# Altium schematic sheet USB Interface.SchDoc: USB Interface
size A4; SheetNumber: 4; SheetTotal: 10; Project: WSN Z1; Comments: CP2102
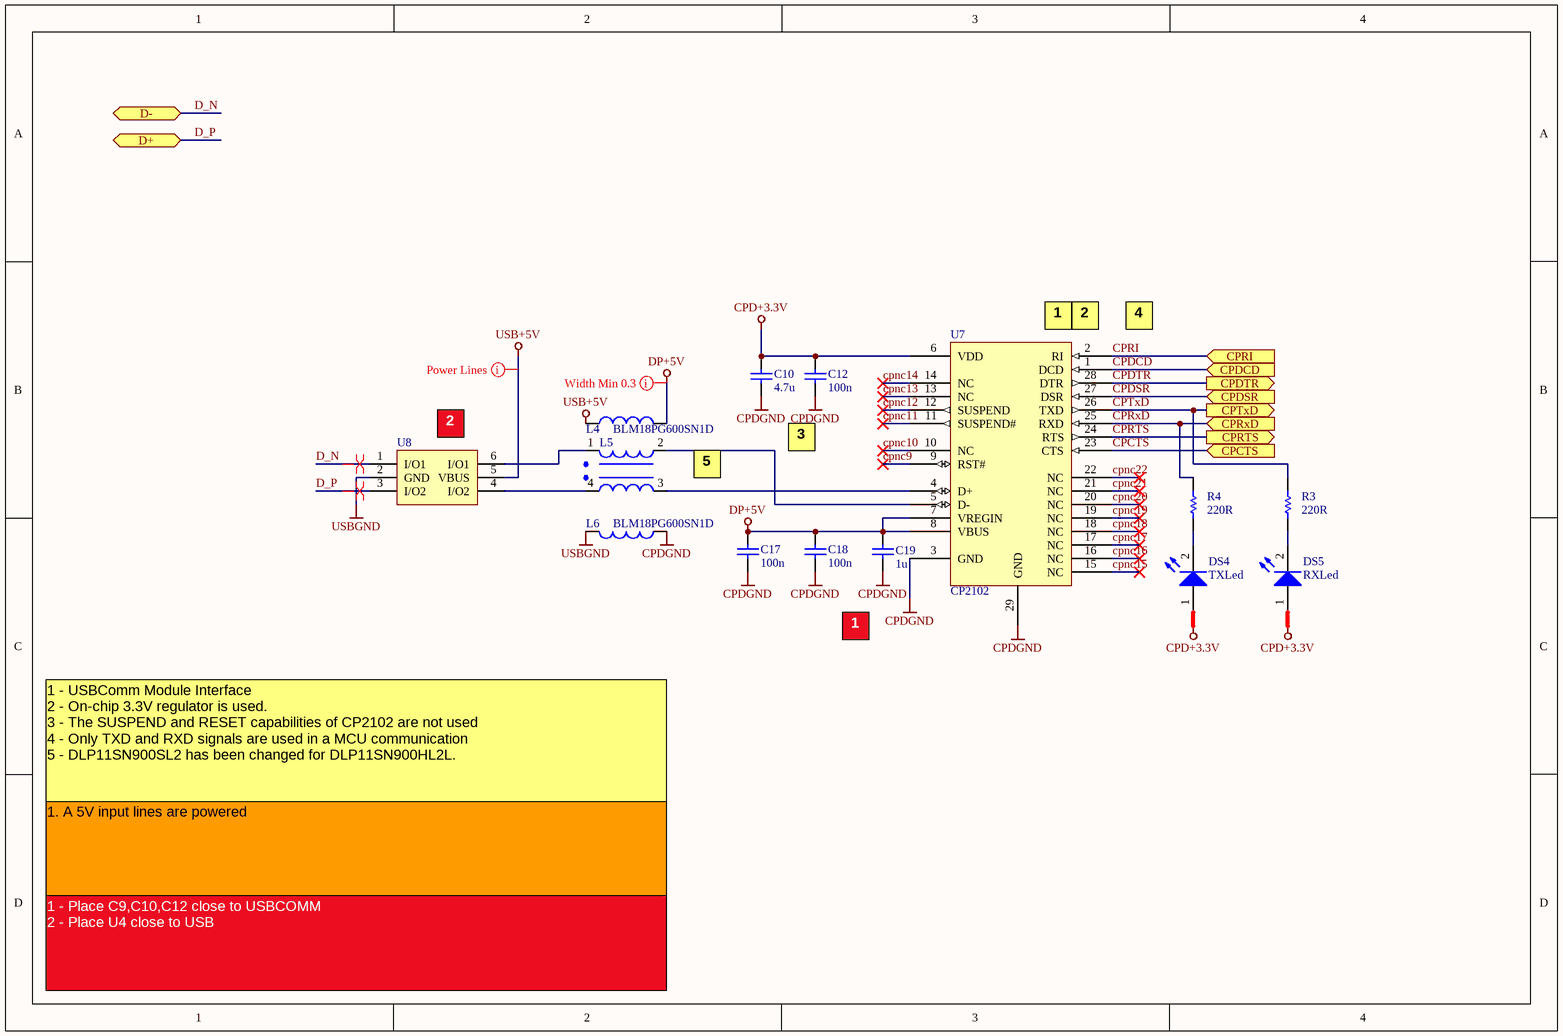
[diagram p0: USB Interface.SchDoc]

## Parts
C10  value 4.7u  [CC1608-0603]  (hidden comment: Cap Semi)
C12  value 100n  [CC-0402-AL]  (hidden comment: Cap Semi)
C17  value 100n  [CC-0402-AL]  (hidden comment: Cap Semi)
C18  value 100n  [CC-0402-AL]  (hidden comment: Cap Semi)
C19  value 1u  [CC1005-0402]  (hidden comment: USB bus decoupling)
DS4  TXLed  [LED0603]
DS5  RXLed  [LED0603]
L4  value BLM18PG600SN1D  [INDC1608-0603]  (hidden comment: Inductor)
L5  DLP11SN900HL2L  [inductor-4pins]  (value not drawn)
L6  value BLM18PG600SN1D  [INDC1608-0603]  (hidden comment: Inductor)
R3  value 220R  [CR-0402-AL]  (hidden comment: Res Semi)
R4  value 220R  [CR-0402-AL]  (hidden comment: Res Semi)
U7  CP2102  [MLP-28]
U8  ESD protection  [SO-G6/E2.4]  (value not drawn)

## Ports
CPCTS (in), CPDCD (in), CPDSR (in), CPDTR (out), CPRI (in), CPRTS (out), CPRxD (in), CPTxD (out), D+ (bidir), D- (bidir)

## Nets
CPD+3.3V: C10.2 C12.1 DS4.1(A) DS5.1(A) U7.6(VDD)
CPDGND: C10.1 C12.2 C17.2 C18.2 C19.2 L6.1 U7.3(GND) U7.29(GND)
DP+5V: C17.1 C18.1 C19.1 L4.2 U7.7(VREGIN) U7.8(VBUS)
USB+5V: L4.1 U8.5(VBUS)
USBGND: L6.2 U8.2(GND)
CPCTS: U7.23(CTS) ; port CPCTS
CPDCD: U7.1(DCD) ; port CPDCD
CPDSR: U7.27(DSR) ; port CPDSR
CPDTR: U7.28(DTR) ; port CPDTR
cpnc9: U7.9(RST#)
cpnc10: U7.10(NC)
cpnc11: U7.11(SUSPEND#)
cpnc12: U7.12(SUSPEND)
cpnc13: U7.13(NC)
cpnc14: U7.14(NC)
cpnc15: U7.15(NC)
cpnc16: U7.16(NC)
cpnc17: U7.17(NC)
cpnc18: U7.18(NC)
cpnc19: U7.19(NC)
cpnc20: U7.20(NC)
cpnc21: U7.21(NC)
cpnc22: U7.22(NC)
CPRI: U7.2(RI) ; port CPRI
CPRTS: U7.24(RTS) ; port CPRTS
CPRxD: R4.2 U7.25(RXD) ; port CPRxD
CPTxD: R3.2 U7.26(TXD) ; port CPTxD
D_N: U8.1(I/O1) ; port D-
D_P: U8.3(I/O2) ; port D+
NetDS4_2: DS4.2(K) R4.1
NetDS5_2: DS5.2(K) R3.1
NetL5_1: L5.1 U8.6(I/O1)
NetL5_2: L5.2 U7.5(D-)
NetL5_3: L5.3 U7.4(D+)
NetL5_4: L5.4 U8.4(I/O2)

## Layout directives
rule Width Constraint [Pref Width = 0.3mm    Min Width = 0.3mm    Max Width = 1mm]: DP+5V
differential pair; rule Differential Pairs Routing [Pref Gap = 0.2mm    Min Gap  = 0.15mm    Max Gap  = 5mm]; rule Width Constraint [Pref Width = 0.2mm    Min Width = 0.15mm    Max Width = 0.8mm]: D_N
differential pair; rule Differential Pairs Routing [Pref Gap = 0.254mm    Min Gap  = 0.15mm    Max Gap  = 5mm]; rule Width Constraint [Pref Width = 0.2mm    Min Width = 0.15mm    Max Width = 0.85mm]: D_P
net class Power Lines; rule Width Constraint [Pref Width = 0.3mm    Min Width = 0.3mm    Max Width = 0.4mm]; rule Power Plane Connect Style [Style - Relief Connect    Expansion = 0.4mm    Width = 0.2mm    Gap = 0.2mm    # Entries = 4]: USB+5V

## Notes on the sheet
- (near U7) 1
- (near U7) 2
- 4
- (near U8) 2
- 3
- 5
- 1
- 1 - USBComm Module Interface
  2 - On-chip 3.3V regulator is used.
  3 - The SUSPEND and RESET capabilities of CP2102 are not used
  4 - Only TXD and RXD signals are used in a MCU communication
  5 - DLP11SN900SL2 has been changed for DLP11SN900HL2L.
- 1. A 5V input lines are powered
- 1 - Place C9,C10,C12 close to USBCOMM
  2 - Place U4 close to USB

## Library data of the parts
C10 C12 C17 C18 = Cap Semi: Capacitor (Semiconductor SIM Model)
C19 = Cap Semi: Chip capacitor, 0603, Y5V, 10V
DS4 = LED2: LED 1.6X0.8MM 589NM YEL CLR SMD
DS5 = LED2: LED 1.6X0.8MM 605NM ORNG CLR SMD
L5 = DLP11SN900SL2: Choke Coil Common Mode 150mA SMD
R3 R4 = Res Semi: Semiconductor Resistor; Manufacturer: Generic Components
U7 = CP2102: USB-to-Serial Converter from Silicon Laboratories; pin to pad: 29>3
U8 = USBLC6-2SC6: VERY LOW CAPACITANCE  ESD PROTECTION